# Altium schematic sheet MC50_Pwr_MotDrv.SchDoc
size A3
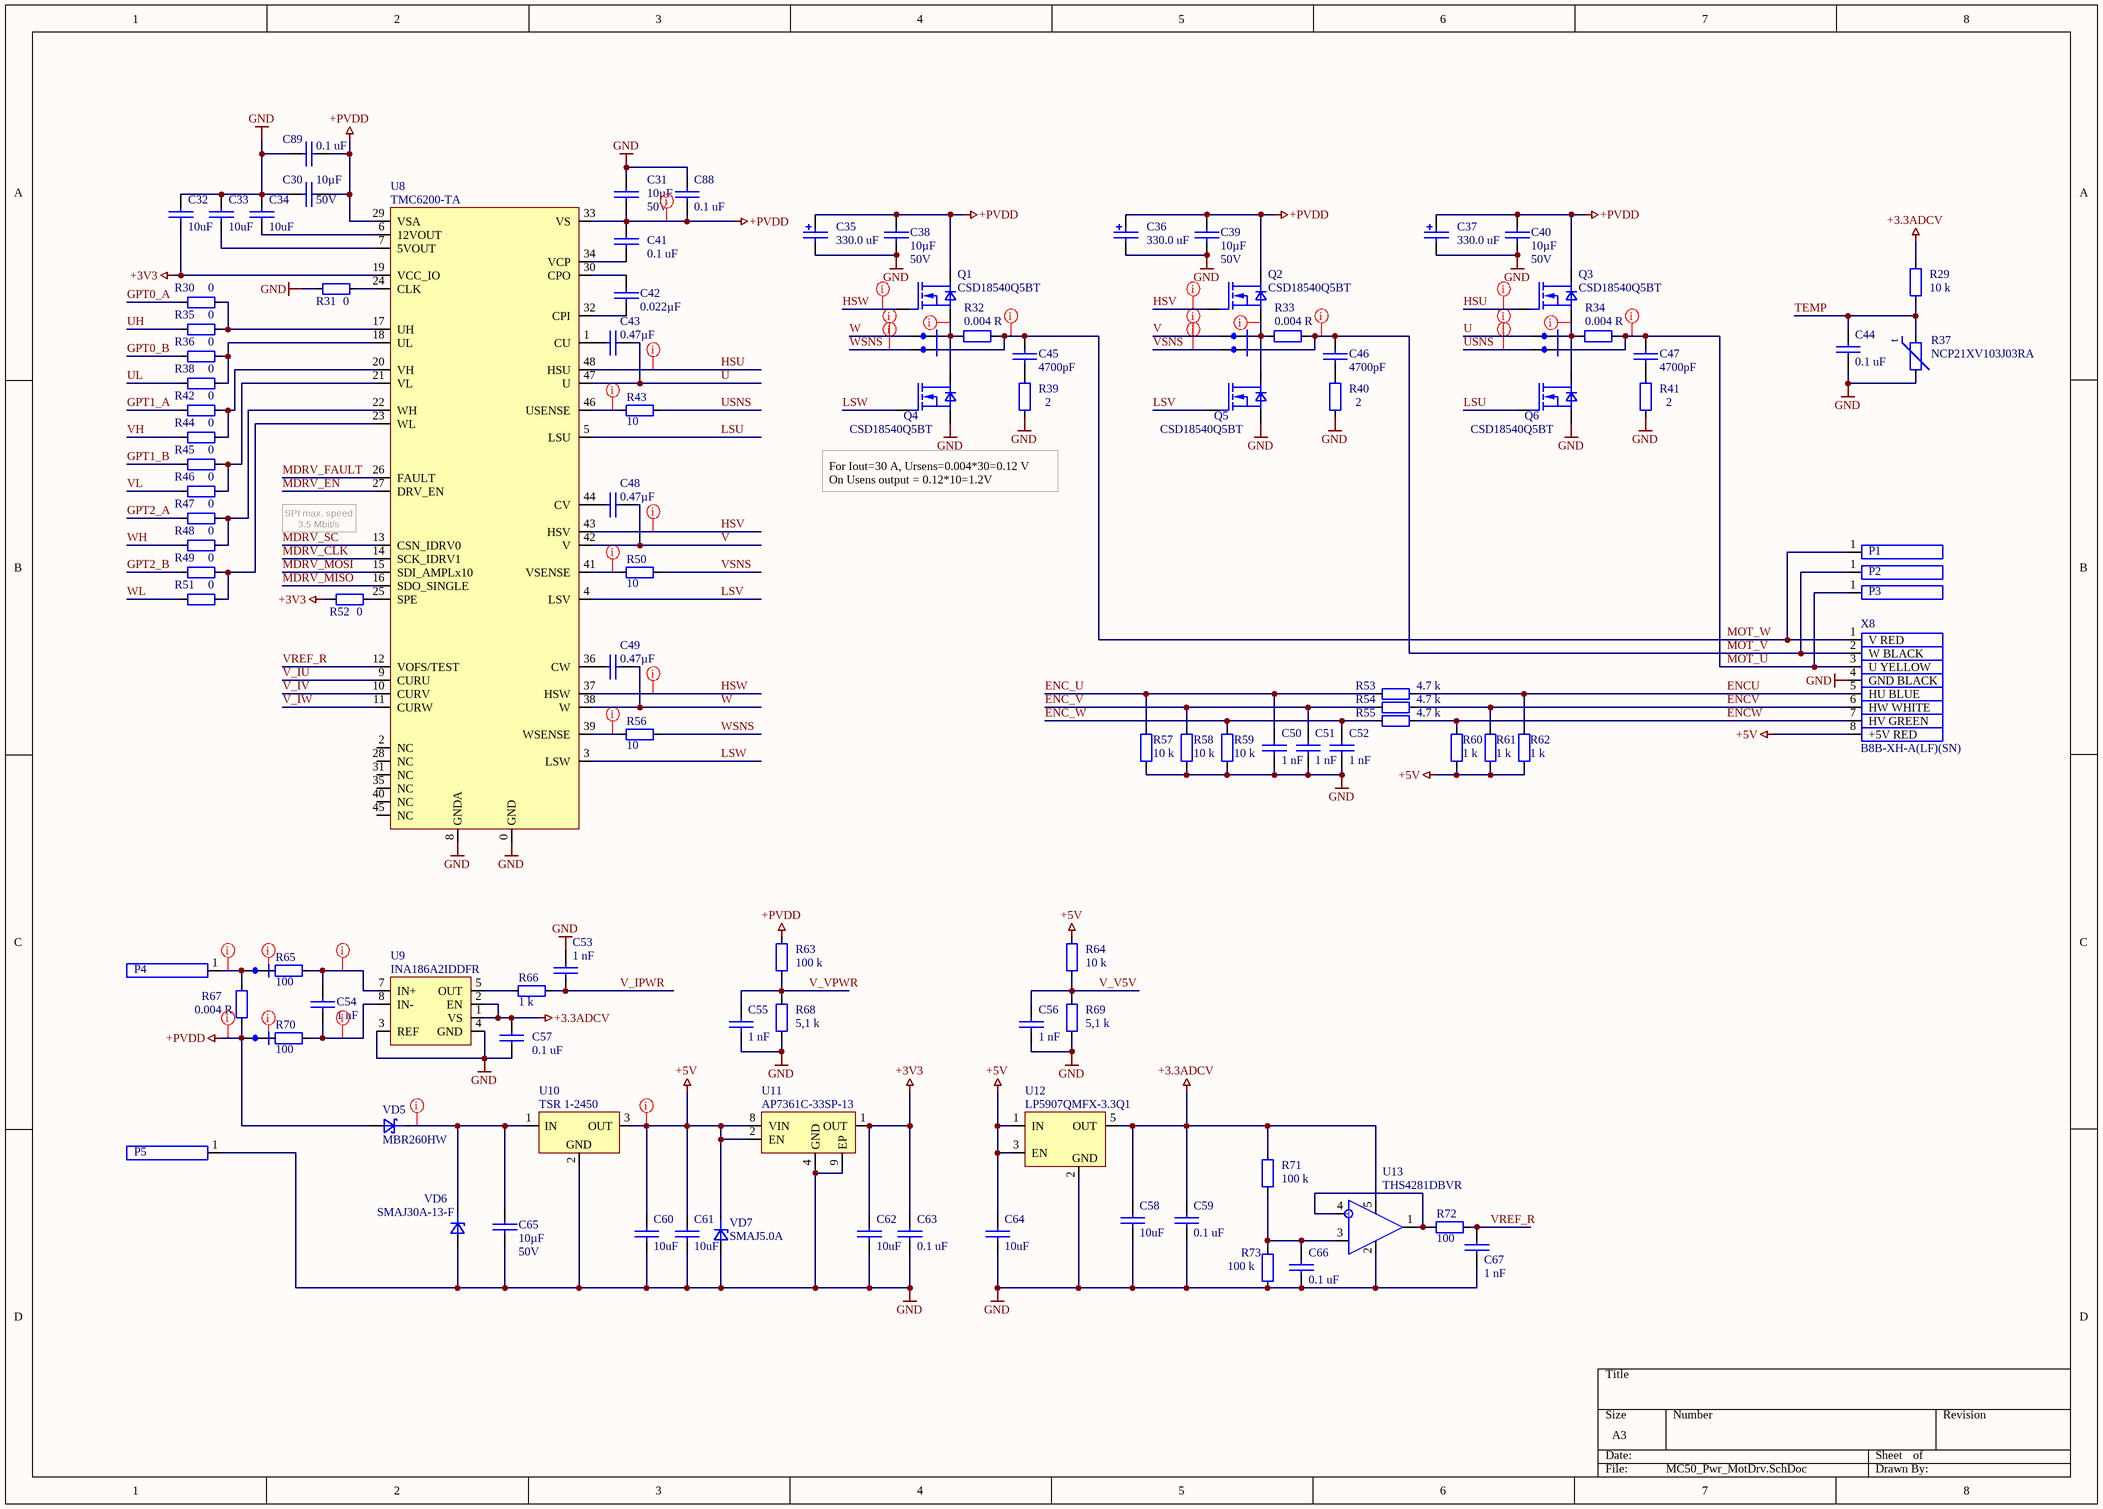
[diagram p0: MC50_Pwr_MotDrv.SchDoc]

## Parts
B1  Current shunt net tie 0.4 mm  [Current shunt net tie 0.4 mm]  (value not drawn)  (net tie, no BOM)
B2  Current shunt net tie 0.4 mm  [Current shunt net tie 0.4 mm]  (value not drawn)  (net tie, no BOM)
B3  Current shunt net tie 0.4 mm  [Current shunt net tie 0.4 mm]  (value not drawn)  (net tie, no BOM)
B4  Current shunt net tie 0.4 mm  [Current shunt net tie 0.4 mm]  (value not drawn)  (net tie, no BOM)
B5  Current shunt net tie 0.4 mm  [Current shunt net tie 0.4 mm]  (value not drawn)  (net tie, no BOM)
B6  Current shunt net tie 0.4 mm  [Current shunt net tie 0.4 mm]  (value not drawn)  (net tie, no BOM)
B7  Current shunt net tie 0.4 mm  [Current shunt net tie 0.4 mm]  (value not drawn)  (net tie, no BOM)
B8  Current shunt net tie 0.4 mm  [Current shunt net tie 0.4 mm]  (value not drawn)  (net tie, no BOM)
C30  value 10µF  Voltage - Rated: 50V  [1210 CAP]  (hidden comment: GCM32EC71H106KA03K)
C31  value 10µF  Voltage - Rated: 50V  [1210 CAP]  (hidden comment: GCM32EC71H106KA03K)
C32  value 10uF  [1608[0603]]  (hidden comment: GRM188R61E106KA73D)
C33  value 10uF  [1608[0603]]  (hidden comment: GRM188R61E106KA73D)
C34  value 10uF  [1608[0603]]  (hidden comment: GRM188R61E106KA73D)
C35  value 330.0 uF  [UUD1V331MNL1GS]  (hidden comment: EEE-FT1H331AP)
C36  value 330.0 uF  [UUD1V331MNL1GS]  (hidden comment: EEE-FT1H331AP)
C37  value 330.0 uF  [UUD1V331MNL1GS]  (hidden comment: EEE-FT1H331AP)
C38  value 10µF  Voltage - Rated: 50V  [1210 CAP]  (hidden comment: GCM32EC71H106KA03K)
C39  value 10µF  Voltage - Rated: 50V  [1210 CAP]  (hidden comment: GCM32EC71H106KA03K)
C40  value 10µF  Voltage - Rated: 50V  [1210 CAP]  (hidden comment: GCM32EC71H106KA03K)
C41  value 0.1 uF  [1608[0603]]  (hidden comment: CL10B104KA8NNND)
C42  value 0.022µF  [0603 CAP]  (hidden comment: 06035C223KAT4A)
C43  value 0.47µF  [0603 CAP]  (hidden comment: Capacitor)
C44  value 0.1 uF  [1608[0603]]  (hidden comment: CL10B104KA8NNND)
C45  value 4700pF  [0805 CAP]  (hidden comment: Capacitor)
C46  value 4700pF  [0805 CAP]  (hidden comment: Capacitor)
C47  value 4700pF  [0805 CAP]  (hidden comment: Capacitor)
C48  value 0.47µF  [0603 CAP]  (hidden comment: Capacitor)
C49  value 0.47µF  [0603 CAP]  (hidden comment: Capacitor)
C50  value 1 nF  [0603 CAP]  (hidden comment: CC0603JRX7R9BB102)
C51  value 1 nF  [0603 CAP]  (hidden comment: CC0603JRX7R9BB102)
C52  value 1 nF  [0603 CAP]  (hidden comment: CC0603JRX7R9BB102)
C53  value 1 nF  [0603 CAP]  (hidden comment: CC0603JRX7R9BB102)
C54  value 1 nF  [0603 CAP]  (hidden comment: CC0603JRX7R9BB102)
C55  value 1 nF  [0603 CAP]  (hidden comment: CC0603JRX7R9BB102)
C56  value 1 nF  [0603 CAP]  (hidden comment: CC0603JRX7R9BB102)
C57  value 0.1 uF  [1608[0603]]  (hidden comment: CL10B104KA8NNND)
C58  value 10uF  [1608[0603]]  (hidden comment: GRM188R61E106KA73D)
C59  value 0.1 uF  [1608[0603]]  (hidden comment: CL10B104KA8NNND)
C60  value 10uF  [1608[0603]]  (hidden comment: GRM188R61E106KA73D)
C61  value 10uF  [1608[0603]]  (hidden comment: GRM188R61E106KA73D)
C62  value 10uF  [1608[0603]]  (hidden comment: GRM188R61E106KA73D)
C63  value 0.1 uF  [1608[0603]]  (hidden comment: CL10B104KA8NNND)
C64  value 10uF  [1608[0603]]  (hidden comment: GRM188R61E106KA73D)
C65  value 10µF  Voltage - Rated: 50V  [1210 CAP]  (hidden comment: GCM32EC71H106KA03K)
C66  value 0.1 uF  [1608[0603]]  (hidden comment: CL10B104KA8NNND)
C67  value 1 nF  [0603 CAP]  (hidden comment: CC0603JRX7R9BB102)
C88  value 0.1 uF  [1608[0603]]  (hidden comment: CL10B104KA8NNND)
C89  value 0.1 uF  [1608[0603]]  (hidden comment: CL10B104KA8NNND)
P1  Keystone 1212  [Keystone 1212]  (value not drawn)
P2  Keystone 1212  [Keystone 1212]  (value not drawn)
P3  Keystone 1212  [Keystone 1212]  (value not drawn)
P4  Keystone 1212  [Keystone 1212]  (value not drawn)
P5  Keystone 1212  [Keystone 1212]  (value not drawn)
Q1  CSD18540Q5BT  [SO8FL Universal Footprint]
Q2  CSD18540Q5BT  [SO8FL Universal Footprint]
Q3  CSD18540Q5BT  [SO8FL Universal Footprint]
Q4  CSD18540Q5BT  [SO8FL Universal Footprint]
Q5  CSD18540Q5BT  [SO8FL Universal Footprint]
Q6  CSD18540Q5BT  [SO8FL Universal Footprint]
R29  value 10 k  [0603]  (hidden comment: Resistor)
R30  value 0  [0603]  (hidden comment: Resistor)
R31  value 0  [0603]  (hidden comment: Resistor)
R32  value 0.004 R  [CSNL2512 CURR SENS]  (hidden comment: CSNL2512FT4L00)
R33  value 0.004 R  [CSNL2512 CURR SENS]  (hidden comment: CSNL2512FT4L00)
R34  value 0.004 R  [CSNL2512 CURR SENS]  (hidden comment: CSNL2512FT4L00)
R35  value 0  [0603]  (hidden comment: Resistor)
R36  value 0  [0603]  (hidden comment: Resistor)
R37  NCP21XV103J03RA  [0805]
R38  value 0  [0603]  (hidden comment: Resistor)
R39  value 2  [0805]  (hidden comment: Resistor)
R40  value 2  [0805]  (hidden comment: Resistor)
R41  value 2  [0805]  (hidden comment: Resistor)
R42  value 0  [0603]  (hidden comment: Resistor)
R43  value 10  [0603]  (hidden comment: ERJ-3EKF10R0V)
R44  value 0  [0603]  (hidden comment: Resistor)
R45  value 0  [0603]  (hidden comment: Resistor)
R46  value 0  [0603]  (hidden comment: Resistor)
R47  value 0  [0603]  (hidden comment: Resistor)
R48  value 0  [0603]  (hidden comment: Resistor)
R49  value 0  [0603]  (hidden comment: Resistor)
R50  value 10  [0603]  (hidden comment: ERJ-3EKF10R0V)
R51  value 0  [0603]  (hidden comment: Resistor)
R52  value 0  [0603]  (hidden comment: Resistor)
R53  value 4.7 k  [0603]  (hidden comment: Resistor)
R54  value 4.7 k  [0603]  (hidden comment: Resistor)
R55  value 4.7 k  [0603]  (hidden comment: Resistor)
R56  value 10  [0603]  (hidden comment: ERJ-3EKF10R0V)
R57  value 10 k  [0603]  (hidden comment: Resistor)
R58  value 10 k  [0603]  (hidden comment: Resistor)
R59  value 10 k  [0603]  (hidden comment: Resistor)
R60  value 1 k  [0603]  (hidden comment: Resistor)
R61  value 1 k  [0603]  (hidden comment: Resistor)
R62  value 1 k  [0603]  (hidden comment: Resistor)
R63  value 100 k  [0603]  (hidden comment: Resistor)
R64  value 10 k  [0603]  (hidden comment: Resistor)
R65  value 100  [0603]  (hidden comment: Resistor)
R66  value 1 k  [0603]  (hidden comment: Resistor)
R67  value 0.004 R  [CSNL2512 CURR SENS]  (hidden comment: CSNL2512FT4L00)
R68  value 5,1 k  [0603]  (hidden comment: Resistor)
R69  value 5,1 k  [0603]  (hidden comment: Resistor)
R70  value 100  [0603]  (hidden comment: Resistor)
R71  value 100 k  [0603]  (hidden comment: Resistor)
R72  value 100  [0603]  (hidden comment: Resistor)
R73  value 100 k  [0603]  (hidden comment: Resistor)
U8  TMC6200-TA  [TQFP48-EP]
U9  INA186A2IDDFR  [TSOT-23-8 TI]
U10  TSR 1-2450  [TSR 1 Traco Power]
U11  AP7361C-33SP-13  [SOIC-8 EDP]
U12  LP5907QMFX-3.3Q1  [SOT23-5]
U13  THS4281DBVR  [SOT23-5]
VD5  MBR260HW  [SOD-123]
VD6  SMAJ30A-13-F  [SMA]
VD7  SMAJ5.0A  [SMA]
X8  B8B-XH-A(LF)(SN)  [B8B-XH-A]

## Nets
+3.3ADCV: C57.2 C58.1 C59.2 R29.2 R71.2 U9.1(VS) U9.2(EN) U12.5(OUT) U13.5(V+)
+3V3: C32.2 C62.1 C63.1 R52.1 U8.19(VCC_IO) U11.1(OUT)
+5V: C60.1 C61.1 C64.1 R60.1 R61.1 R62.1 R64.2 U10.3(OUT) U11.2(EN) U11.8(VIN) U12.1(IN) U12.3(EN) VD7.1 X8.8(+5V_RED)
+PVDD: B8.2 C30.2 C31.2 C35.1 C36.1 C37.1 C38.1 C39.1 C40.1 C41.2 C88.1 C89.1 Q1.3(D) Q2.3(D) Q3.3(D) R63.2 R67.1 U8.29(VSA) U8.33(VS) VD5.2(A)
GND: C30.1 C31.1 C32.1 C33.1 C34.1 C35.2 C36.2 C37.2 C38.2 C39.2 C40.2 C44.1 C50.2 C51.2 C52.2 C53.1 C55.2 C56.2 C57.1 C58.2 C59.1 C60.2 C61.2 C62.2 C63.2 C64.2 C65.1 C66.1 C67.2 C88.2 C89.2 P5.1 Q4.2(S) Q5.2(S) Q6.2(S) R31.1 R37.1 R39.1 R40.1 R41.1 R57.1 R58.1 R59.1 R68.1 R69.1 R73.1 U8.0(GND) U8.8(GNDA) U9.3(REF) U9.4(GND) U10.2(GND) U11.4(GND) U11.9(EP) U12.2(GND) U13.2(GND) VD6.2 VD7.2 X8.4(GND_BLACK)
ENC_U: C50.1 R53.2 R57.2
ENC_V: C51.1 R54.2 R58.2
ENC_W: C52.1 R55.2 R59.2
ENCU: R53.1 R62.2 X8.5(HU_BLUE)
ENCV: R54.1 R61.2 X8.6(HW_WHITE)
ENCW: R55.1 R60.2 X8.7(HV_GREEN)
GPT0_A: R30.1
GPT0_B: R36.1
GPT1_A: R42.1
GPT1_B: R45.1
GPT2_A: R47.1
GPT2_B: R49.1
HSU: Q3.1(G) U8.48(HSU)
HSV: Q2.1(G) U8.43(HSV)
HSW: Q1.1(G) U8.37(HSW)
LSU: Q6.1(G) U8.5(LSU)
LSV: Q5.1(G) U8.4(LSV)
LSW: Q4.1(G) U8.3(LSW)
MDRV_CLK: U8.14(SCK_IDRV1)
MDRV_EN: U8.27(DRV_EN)
MDRV_FAULT: U8.26(FAULT)
MDRV_MISO: U8.16(SDO_SINGLE)
MDRV_MOSI: U8.15(SDI_AMPLx10)
MDRV_SC: U8.13(CSN_IDRV0)
MOT_U: B6.1 C47.1 P3.1 R34.2 X8.3(U_YELLOW)
MOT_V: B5.1 C46.1 P2.1 R33.2 X8.2(W_BLACK)
MOT_W: B4.1 C45.1 P1.1 R32.2 X8.1(V_RED)
TEMP: C44.2 R29.1 R37.2
U: B3.2 C43.2 U8.47(U)
UH: R35.1
UL: R38.1
USNS: B6.2 R43.2
V: B2.2 C48.2 U8.42(V)
V_IPWR: C53.2 R66.2
V_IU: U8.9(CURU)
V_IV: U8.10(CURV)
V_IW: U8.11(CURW)
V_V5V: C56.1 R64.1 R69.2
V_VPWR: C55.1 R63.1 R68.2
VH: R44.1
VL: R46.1
VREF_R: C67.1 R72.1 U8.12(VOFS/TEST)
VSNS: B5.2 R50.2
W: B1.2 C49.2 U8.38(W)
WH: R48.1
WL: R51.1
WSNS: B4.2 R56.2
NetB1_1: B1.1 Q1.2(S) Q4.3(D) R32.1
NetB2_1: B2.1 Q2.2(S) Q5.3(D) R33.1
NetB3_1: B3.1 Q3.2(S) Q6.3(D) R34.1
NetB7_1: B7.1 R65.1
NetB7_2: B7.2 P4.1 R67.2
NetB8_1: B8.1 R70.2
NetC33_2: C33.2 U8.7(5VOUT)
NetC34_2: C34.2 U8.6(12VOUT)
NetC41_1: C41.1 U8.34(VCP)
NetC42_1: C42.1 U8.30(CPO)
NetC42_2: C42.2 U8.32(CPI)
NetC43_1: C43.1 U8.1(CU)
NetC45_2: C45.2 R39.2
NetC46_2: C46.2 R40.2
NetC47_2: C47.2 R41.2
NetC48_1: C48.1 U8.44(CV)
NetC49_1: C49.1 U8.36(CW)
NetC54_1: C54.1 R70.1 U9.8(IN-)
NetC54_2: C54.2 R65.2 U9.7(IN+)
NetC65_2: C65.2 U10.1(IN) VD5.1(C) VD6.1
NetC66_2: C66.2 R71.1 R73.2 U13.3(IN+)
NetR30_2: R30.2 R35.2 U8.17(UH)
NetR31_2: R31.2 U8.24(CLK)
NetR36_2: R36.2 R38.2 U8.18(UL)
NetR42_2: R42.2 R44.2 U8.20(VH)
NetR43_1: R43.1 U8.46(USENSE)
NetR45_2: R45.2 R46.2 U8.21(VL)
NetR47_2: R47.2 R48.2 U8.22(WH)
NetR49_2: R49.2 R51.2 U8.23(WL)
NetR50_1: R50.1 U8.41(VSENSE)
NetR52_2: R52.2 U8.25(SPE)
NetR56_1: R56.1 U8.39(WSENSE)
NetR66_1: R66.1 U9.5(OUT)
NetR72_2: R72.2 U13.1(OUT) U13.4(IN-)

Not connected (* = marked no-connect by the designer): U8 2(NC) 28(NC) 31(NC) 35(NC) 40(NC) 45(NC)

## Layout directives
net class 24V; net class W: HSW, MOT_W, NetB1_1, W, WSNS
net class 24V; net class V: HSV, MOT_V, NetB2_1, V, VSNS
net class 24V; net class U: HSU, MOT_U, NetB3_1, U, USNS
net class 5V: +5V
net class 24V: +PVDD, HSU, HSV, HSW, NetC54_1, NetC54_2, NetC65_2, NetR43_1, NetR50_1, NetR56_1
net class 24V; net class PWR: +PVDD, NetB7_1, NetB7_2, NetB8_1

## Notes on the sheet
- For Iout=30 A, Ursens=0.004*30=0.12 V
  On Usens output = 0.12*10=1.2V
- (near U8) SPI max. speed 3.5 Mbit/s
- (in symbol NCP21XV103J03RA) t

## Library data of the parts
C30 C31 C38-C40 C65 = GCM32EC71H106KA03K: 10µF, ±10%, 50V, X7S, 1210 (3225 Metric), -55°C ~ 125°C, -, Automotive; Manufacturer: Murata Electronics North America; PartNum: 490-14535-1-ND; Part Number: GCM32EC71H106KA03K; Distributor: Digi-Key; PartName: GCM32EC71H106KA03K; Price: 0.64430; Tolerance: ±10%; Temperature Coefficient: X7S; Operating Temperature: -55°C ~ 125°C; Features: -; Package / Case: 1210 (3225 Metric)
C32-C34 C58 C60-C62 C64 = GRM188R61E106KA73D: 10 µF ±10% 25V Ceramic Capacitor X5R 0603 (1608 Metric), -55°C ~ 85°C; Manufacturer: Murata Electronics; PartNum: 490-18214-1-ND; Tolerance: ±10%; Price: 0.41$; Distributor: Digi-Key; Voltage: 25V; PartName: GRM188R61E106KA73D
C35-C37 = EEE-FT1H331AP: 330 uF, 50V, 120 mOhm @ 100kHz, 585 mA, 10x10, -50...+105 C; Manufacturer: Panasonic Electronic Components; PartNum: PCE5026CT-ND; Tolerance: ±20%; Voltage: 50 V; Distributor: Digi-Key; PartName: EEE-FT1H331AP
C41 C44 C57 C59 C63 C66 C88 C89 = 0603B104K500CT: 0.1 µF ±10% 50V Ceramic Capacitor X7R 0603 (1608 Metric), / -55°C ~ 125°C; Manufacturer: Walsin Technology Corporation; PartNum: 1292-1643-1-ND; Tolerance: +-10%; Distributor: Digi-Key; PartName: 0603B104K500CT; Voltage: 50V; Price: 0.0062 Euro
C42 = 06035C223KAT4A: 0.022µF, ±10%, 50V, X7R, 0603 (1608 Metric), -55°C ~ 125°C, -, General Purpose; Manufacturer: AVX Corporation; PartNum: 478-7019-1-ND; Part Number: 06035C223KAT4A; Distributor: Digi-Key; PartName: 06035C223KAT4A; Price: 0.04380; Tolerance: ±10%; Voltage - Rated: 50V; Temperature Coefficient: X7R; Operating Temperature: -55°C ~ 125°C; Features: -; Package / Case: 0603 (1608 Metric); Supplier 1: Farnell; Supplier Part Number 1: 3288928
C43 C48 C49 = CL10F474ZB8NNNC: 0.47µF, -20%, +80%, 50V, Y5V (F), 0603 (1608 Metric), -30°C ~ 85°C, -, General Purpose; Manufacturer: Samsung Electro-Mechanics; PartNum: 1276-2377-1-ND; Temperature Coefficient: Y5V (F); Part Number: CL10F474ZB8NNNC; Distributor: Digi-Key; PartName: CL10F474ZB8NNNC; Price: 0.04580; Tolerance: -20%, +80%; Voltage - Rated: 50V; Operating Temperature: -30°C ~ 85°C; Features: -; Package / Case: 0603 (1608 Metric)
C45-C47 = CL21B472KCANNNC: 4700pF, ±10%, 100V, X7R, 0805 (2012 Metric), -55°C ~ 125°C, -, General Purpose; Manufacturer: Samsung Electro-Mechanics; PartNum: 1276-2524-1-ND; Voltage - Rated: 100V; Part Number: CL21B472KCANNNC; Distributor: Digi-Key; PartName: CL21B472KCANNNC; Price: 0.11000; Tolerance: ±10%; Temperature Coefficient: X7R; Operating Temperature: -55°C ~ 125°C; Features: -; Package / Case: 0805 (2012 Metric)
C50-C56 C67 = CC0603JRX7R9BB102: 1000pF, ±5%, 50V, X7R, 0603 (1608 Metric), -55°C ~ 125°C, -, General Purpose; Manufacturer: Yageo; PartNum: 311-3361-1-ND; Voltage - Rated: 50V; Part Number: CC0603JRX7R9BB102; Distributor: Digi-Key; PartName: CC0603JRX7R9BB102; Price: 0.01920; Tolerance: ±5%; Temperature Coefficient: X7R; Operating Temperature: -55°C ~ 125°C; Features: -; Package / Case: 0603 (1608 Metric)
P1-P5 = Keystone_1212: (4.75mm) Quick Connect Male Solder Connector Non-Insulated; Manufacturer: Keystone Electronics; PartNum: 36-1212-ND; Distributor: Digi-Key; PartName: Keystone 1212
Q1-Q6 = CSD18540Q5BT: MOSFET N-CH, 100 A, 60V, Vgs=±20V, 1.8 mOhm, 41nC @ 10V, 5-DFN (5x6), -55°C ~ 150°C; Manufacturer: Texas Instruments; PartNum: 296-37963-1-ND; Price: 2.32 Euro; Distributor: Digi-Key; PartName: CSD18540Q5BT; Supplier 1: Digi-Key; Supplier Part Number 1: 296-37963-1-ND
R29 R64 = RNCF0603BTE10K0: 10 kOhms, ±0.1%, 0.1W, 1/10W, Thin Film, ±25ppm/°C, 0603 (1608 Metric), -55°C ~ 155°C, Automotive AEC-Q200; Manufacturer: Stackpole Electronics Inc; PartNum: RNCF0603BTE10K0CT-ND; Voltage: 75V; Distributor: Digi-Key; Price: 0.259; Tolerance: ±0.1%; PartName: RNCF0603BTE10K0; Part Number: RNCF0603BTE10K0; Temperature Coefficient: ±25ppm/°C; Operating Temperature: -55°C ~ 155°C; Power (Watts): 0.1W, 1/10W; Features: Automotive AEC-Q200; Package / Case: 0603 (1608 Metric)
R30 R31 R35 R36 R38 R42 R44-R49 R51 R52 = RMCF0603ZT0R00: 0 Ohms, 0.1W, 1/10W, Thick Film, 0603 (1608 Metric), -55°C ~ 155°C, Automotive AEC-Q200; Manufacturer: Stackpole Electronics Inc.; PartNum: RMCF0603ZT0R00CT-ND; Distributor: Digi-Key; Price: 0.00690; Tolerance: -; Voltage: -; PartName: RMCF0603ZT0R00; Part Number: RMCF0603ZT0R00; Temperature Coefficient: -; Operating Temperature: -55°C ~ 155°C; Power (Watts): 0.1W, 1/10W; Features: Automotive AEC-Q200; Package / Case: 0603 (1608 Metric)
R32-R34 R67 = CSNL2512FT4L00: Curr.sens.res. 0.004 OHM, 2W, 1% , ±50ppm/°C, 2512 (6432 Metric); Manufacturer: Stackpole Electronics Inc.; PartNum: CSNL2512FT4L00CT-ND; Distributor: Digi-Key; Tolerance: ±1%; PartName: CSNL2512FT4L00
R37 = NCP21XV103J03RA: Thermistor 10k, 0805, NTC; Manufacturer: Murata; PartNum: 490-2456-1-ND; Distributor: Digi-Key; Value: 10 K; PartName: NCP21XV103J03RA
R39-R41 = CRCW08052R00FKEAC: 2 Ohms, ±1%, 0.125W, 1/8W, Thick Film, ±100ppm/°C, 0805 (2012 Metric), -55°C ~ 155°C, -; Manufacturer: Vishay Dale; PartNum: 541-4155-1-ND; Voltage: 150V; Distributor: Digi-Key; Price: 0.01950; Tolerance: ±1%; PartName: CRCW08052R00FKEAC; Part Number: CRCW08052R00FKEAC; Temperature Coefficient: ±100ppm/°C; Operating Temperature: -55°C ~ 155°C; Power (Watts): 0.125W, 1/8W; Features: -; Package / Case: 0805 (2012 Metric)
R43 R50 R56 = ERJ-3EKF10R0V: 10 Ohms, ±1%, 0.1W, 1/10W, Thick Film, ±100ppm/°C, 0603 (1608 Metric), -55°C ~ 155°C, Automotive AEC-Q200; Manufacturer: Panasonic Electronic Components; PartNum: P10.0HCT-ND; Voltage: 75V; Distributor: Digi-Key; Price: 0.02570; Tolerance: ±1%; PartName: ERJ-3EKF10R0V; Part Number: ERJ-3EKF10R0V; Temperature Coefficient: ±100ppm/°C; Operating Temperature: -55°C ~ 155°C; Power (Watts): 0.1W, 1/10W; Features: Automotive AEC-Q200; Package / Case: 0603 (1608 Metric); Supplier 1: Farnell; Supplier Part Number 1: 2397504
R53-R55 = RMCF0603FT4K70: 4.7 kOhms, ±1%, 0.1W, 1/10W, Thick Film, ±100ppm/°C, 0603 (1608 Metric), -55°C ~ 155°C, Automotive AEC-Q200; Manufacturer: Stackpole Electronics Inc.; PartNum: RMCF0603FT4K70CT-ND; Voltage: 75V; Distributor: Digi-Key; Price: 0.00690; Tolerance: ±1%; PartName: RMCF0603FT4K70; Part Number: RMCF0603FT4K70; Temperature Coefficient: ±100ppm/°C; Operating Temperature: -55°C ~ 155°C; Power (Watts): 0.1W, 1/10W; Features: Automotive AEC-Q200; Package / Case: 0603 (1608 Metric)
R57-R59 = CR0603-FX-1002GLF: 10 kOhms, ±1%, 0.1W, 1/10W, Thick Film, ±100ppm/°C, 0603 (1608 Metric), -55°C ~ 155°C, Moisture Resistant; Manufacturer: Bourns Inc.; PartNum: CR0603-FX-1002GLFCT-ND; Voltage: 75V; Distributor: Digi-Key; Price: 0.00860; Tolerance: ±1%; PartName: CR0603-FX-1002GLF; Part Number: CR0603-FX-1002GLF; Temperature Coefficient: ±100ppm/°C; Operating Temperature: -55°C ~ 155°C; Power (Watts): 0.1W, 1/10W; Features: Moisture Resistant; Package / Case: 0603 (1608 Metric)
R60-R62 R66 = RMCF0603FG1K00: 1 kOhms, ±1%, 0.1W, 1/10W, Thick Film, ±100ppm/°C, 0603 (1608 Metric), -55°C ~ 155°C, Automotive AEC-Q200; Manufacturer: Stackpole Electronics Inc.; PartNum: RMCF0603FG1K00CT-ND; Voltage: 75V; Distributor: Digi-Key; Price: 0.00690; Tolerance: ±1%; PartName: RMCF0603FG1K00; Part Number: RMCF0603FG1K00; Temperature Coefficient: ±100ppm/°C; Operating Temperature: -55°C ~ 155°C; Power (Watts): 0.1W, 1/10W; Features: Automotive AEC-Q200; Package / Case: 0603 (1608 Metric)
R63 R71 R73 = RG1608P-104-B-T5: 100 kOhms, ±0.1%, 0.1W, 1/10W, Thin Film, ±25ppm/°C, 0603 (1608 Metric), -55°C ~ 155°C, Anti-Sulfur, Automotive AEC-Q200; Manufacturer: Susumu; PartNum: RG16P100KBCT-ND; Voltage: 75V; Distributor: Digi-Key; Price: 0.259; Tolerance: ±0.1%; PartName: RG1608P-104-B-T5; Part Number: RG1608P-104-B-T5; Temperature Coefficient: ±25ppm/°C; Operating Temperature: -55°C ~ 155°C; Power (Watts): 0.1W, 1/10W; Features: Anti-Sulfur, Automotive AEC-Q200; Package / Case: 0603 (1608 Metric)
R65 R70 R72 = RMCF0603FT100R: 100 Ohms, ±1%, 0.1W, 1/10W, Thick Film, ±100ppm/°C, 0603 (1608 Metric), -55°C ~ 155°C, Automotive AEC-Q200; Manufacturer: Stackpole Electronics Inc.; PartNum: RMCF0603FT100RCT-ND; Voltage: 75V; Distributor: Digi-Key; Price: 0.00690; Tolerance: ±1%; PartName: RMCF0603FT100R; Part Number: RMCF0603FT100R; Temperature Coefficient: ±100ppm/°C; Operating Temperature: -55°C ~ 155°C; Power (Watts): 0.1W, 1/10W; Features: Automotive AEC-Q200; Package / Case: 0603 (1608 Metric)
R68 R69 = TNPW06035K10BEEA: 5,1 kOhms, ±0.1%, 0.125W, 1/8W, Thin Film, ±25ppm/°C, 0603 (1608 Metric), -55°C ~ 155°C, Anti-Sulfur, Automotive AEC-Q200, Moisture Resistant; Manufacturer: Vishay Dale; PartNum: 541-2035-1-ND; Voltage: 75V; Distributor: Digi-Key; Price: 0.4; Tolerance: ±0.1%; PartName: TNPW06035K10BEEA; Part Number: TNPW06035K10BEEA; Temperature Coefficient: ±25ppm/°C; Operating Temperature: -55°C ~ 155°C; Power (Watts): 0.125W, 1/8W; Features: Anti-Sulfur, Automotive AEC-Q200, Moisture Resistant; Package / Case: 0603 (1608 Metric)
U8 = TMC6200-TA: Three Phase Automotive Gate Driver with Three Integrated Current Shunt Amplifiers and Voltage Regulator, PHP0048G; Manufacturer: Trinamic Motion Control GmbH; PartNum: 1460-1384-ND; Distributor: Digi-Key; Price: 2.6; PartName: TMC6200-TA
U9 = INA186A2IDDFR: Current Sense Amplifier, 50V/V, 37 kHz, Vcm=–0.2 V to +40 V, Vcc=1.7V ~ 5.5V, , Icc=48µA, -40°C ~ 125°C, TSOT-23-8; Manufacturer: Texas Instruments; PartNum: 296-INA186A2IDDFRCT-ND; Price: 1.1; Distributor: Digi-Key; PartName: INA186A2IDDFR
U10 = TSR 1-2450: Linear Regulator Replacement DC DC Converter 5W, 5V, 1A, 6.5V - 36V Input, -40°C ~ 85°C; Manufacturer: Traco Power; PartNum: 1951-2747-ND; Distributor: Digi-Key; price: 3.9$; PartName: TSR 1-2450
U11 = AP7361C-33SP-13: LDO, 3.3 V, 1A, 0.36V@1A, Vin=6V max, -40..+85C, 8-SO-EP; PartNum: AP7361C-33SP-13DICT-ND; Manufacturer: Diodes Incorporated; Distributor: Digi-Key; Price: 0.56$; PartName: AP7361C-33SP-13; Supplier 1: Digi-Key; Supplier Part Number 1: AP7361C-33SP-13DICT-ND
U12 = LP5907QMFX-3.3Q1: LDO 3.3 V, 250 mA, Vin < 5.5V, Iq < 12uA, -40..+125 C, SOT23-5; Manufacturer: Texas Instruments; PartNum: 296-40365-1-ND; Distributor: Digi-Key; PartName: LP5907QMFX-3.3Q1
U13 = THS4281DBVR: Voltage Feedback Amplifier 1 Circuit Rail-to-Rail SOT-23-5; Manufacturer: Texas Instruments; PartNum: 296-39224-1-ND; Distributor: Digi-Key; PartName: THS4281DBVR
VD5 = APD240KDTR-G1: Diode Schottky  60V, 2A, 660mV @ 2A, -, SOD-123, -55°C ~ 150°C; Manufacturer: Diodes Incorporated; PartNum: 1655-MBR260HWCT-ND; Voltage - DC Reverse (Vr) (Max): 40V; Voltage - Forward (Vf) (Max) @ If: 500mV @ 2A; Speed: Fast Recovery =< 500ns, > 200mA (Io); Current - Reverse Leakage @ Vr: 500µA @ 40V; PartName: MBR260HW; Part Number: APD240KDTR-G1; Distributor: Digi-Key; Price: 0.19370; Current - Average Rectified (Io): 2A; Reverse Recovery Time (trr): -; Operating Temperature: -65°C ~ 125°C; Package / Case: SOD-123
VD6 = SMAJ30A-13-F: 48.4V Clamp 8.3A Ipp Tvs Diode Surface Mount SMA,; Manufacturer: Diodes Incorporated; PartNum: SMAJ30A-FDICT-ND; Voltage: 30 V; Distributor: Digi-Key; Price: 0.18$; PartName: SMAJ30A-13-F
VD7 = SMAJ5.0A: 9.2V Clamp 43.5A Ipp Tvs Diode Surface Mount SMA, -55°C ~ 150°C (TJ); Manufacturer: Littelfuse Inc.; PartNum: SMAJ5.0ALFCT-ND; Voltage: 30 V; Distributor: Digi-Key; Price: 0.18$; PartName: SMAJ5.0A
X8 = B8B-XH-A(LF)(SN): CONN HEADER XH TOP 8POS 2.5MM; Manufacturer: JST Sales America Inc.; PartNum: 455-2251-ND; Distributor: Digi-Key; PartName: B8B-XH-A(LF)(SN)